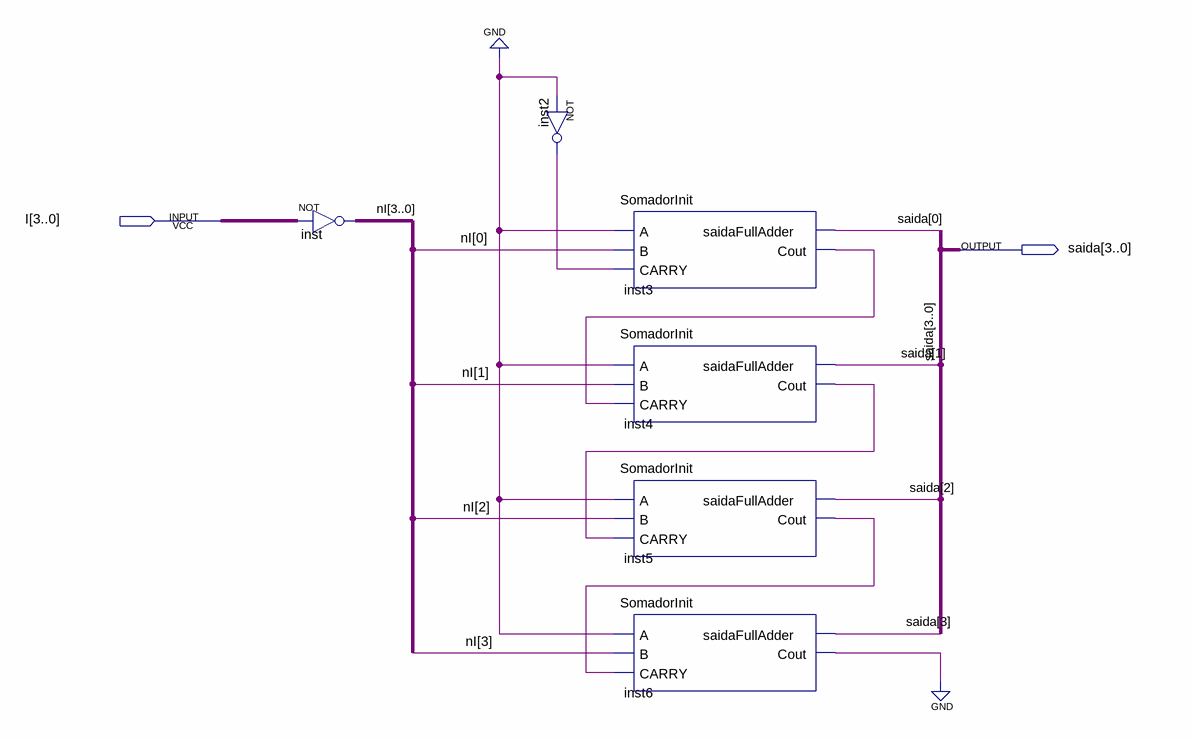
[diagram p0: schematic sheet]
// Quartus schematic comp2sub.bdf as structural Verilog: 6 symbols, 2 pins
module comp2sub (
  input  [3:0] I,
  output [3:0] saida
);

  wire inst2_out, inst3_cout, inst4_cout, inst5_cout, inst6_cout;
  wire [3:0] nI;

  assign nI = ~I;  // NOT inst, 4 bits wide
  not inst2 (inst2_out, 1'b0);
  SomadorInit inst3 (.A(1'b0), .B(nI[0]), .CARRY(inst2_out), .saidaFullAdder(saida[0]), .Cout(inst3_cout));
  SomadorInit inst4 (.A(1'b0), .B(nI[1]), .CARRY(inst3_cout), .saidaFullAdder(saida[1]), .Cout(inst4_cout));
  SomadorInit inst5 (.A(1'b0), .B(nI[2]), .CARRY(inst4_cout), .saidaFullAdder(saida[2]), .Cout(inst5_cout));
  SomadorInit inst6 (.A(1'b0), .B(nI[3]), .CARRY(inst5_cout), .saidaFullAdder(saida[3]), .Cout(inst6_cout));
  // also tied to GND on the sheet: inst6_cout
endmodule
